# EAGLE design ESP8266 (EAGLE 7.6.0)
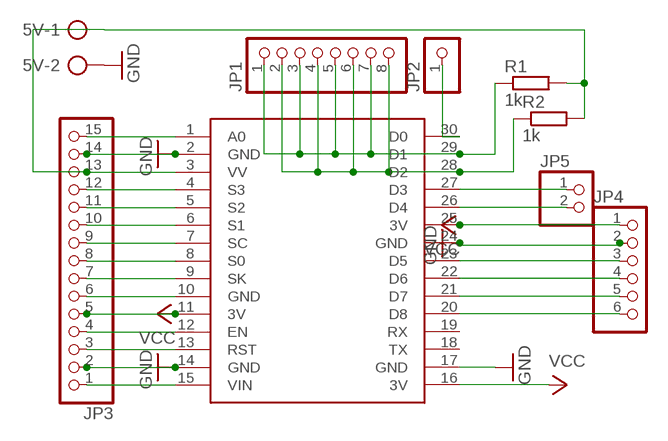
[diagram p0: schematic, sheet 1]

## Parts
5V  AK300/2  [AK300/2]
JP1  PINHD-1X8  [1X08]
JP2  PINHD-1X1  [1X01]
JP3  PINHD-1X15  [1X15]
JP4  PINHD-1X6  [1X06]
JP5  PINHD-1X2  [1X02]
R1  1k  R-EU_0204/7  [0204/7]
R2  1k  R-EU_0204/7  [0204/7]
U$1  NODEMCU  [NODEMCU]

## Nets
GND: 5V.2 JP3.2 JP3.14 JP4.2 U$1.2(GND) U$1.14(GND) U$1.17(GND) U$1.24(GND)
N$1: JP3.1 U$1.15(VIN)
N$2: JP3.3 U$1.13(RST)
N$3: JP3.4 U$1.12(EN)
N$4: JP3.6 U$1.10(GND)
N$5: JP3.7 U$1.9(SK)
N$6: JP3.8 U$1.8(S0)
N$7: JP3.9 U$1.7(SC)
N$8: JP3.10 U$1.6(S1)
N$9: JP3.11 U$1.5(S2)
N$10: JP3.12 U$1.4(S3)
N$11: 5V.1 JP3.13 R1.2 R2.2 U$1.3(VV)
N$12: JP3.15 U$1.1(A0)
N$13: JP2.1
N$14: JP4.3 U$1.23(D5)
N$15: JP4.4 U$1.22(D6)
N$16: JP4.5 U$1.21(D7)
N$17: JP4.6 U$1.20(D8)
N$18: JP5.1 U$1.27(D3)
N$19: JP5.2 U$1.26(D4)
SCL: JP1.1 JP1.3 JP1.5 JP1.7 R1.1 U$1.29(D1)
SDA: JP1.2 JP1.4 JP1.6 JP1.8 R2.1 U$1.28(D2)
VCC: JP3.5 JP4.1 U$1.11(3V) U$1.16(3V) U$1.25(3V)
Unconnected: U$1.18(TX) U$1.19(RX) U$1.30(D0)

## Library data of the parts
5V = con-ptr500:AK300/2: CONNECTOR; OC_FARNELL: unknown; OC_NEWARK: unknown
JP1 = pinhead:PINHD-1X8: PIN HEADER
JP2 = pinhead:PINHD-1X1: PIN HEADER
JP3 = pinhead:PINHD-1X15: PIN HEADER
JP4 = pinhead:PINHD-1X6: PIN HEADER
JP5 = pinhead:PINHD-1X2: PIN HEADER
R1 R2 = rcl:R-EU_: RESISTOR, European symbol
U$1 = nodemcu:NODEMCU

## Board
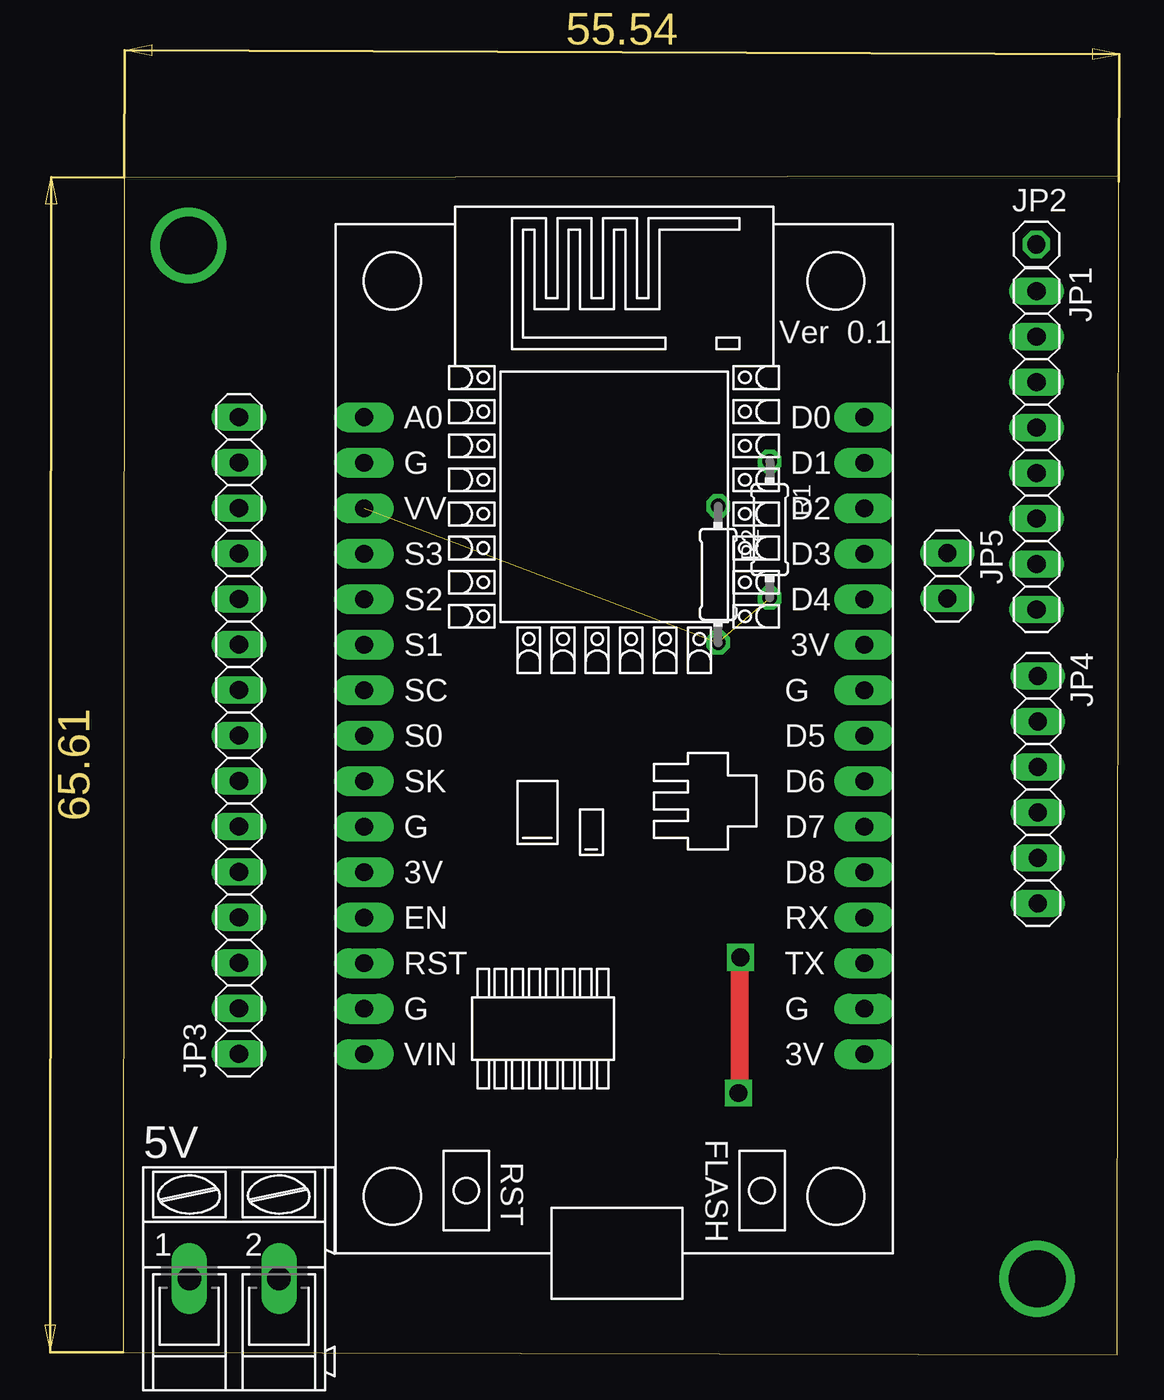
[diagram p1: board, top side]
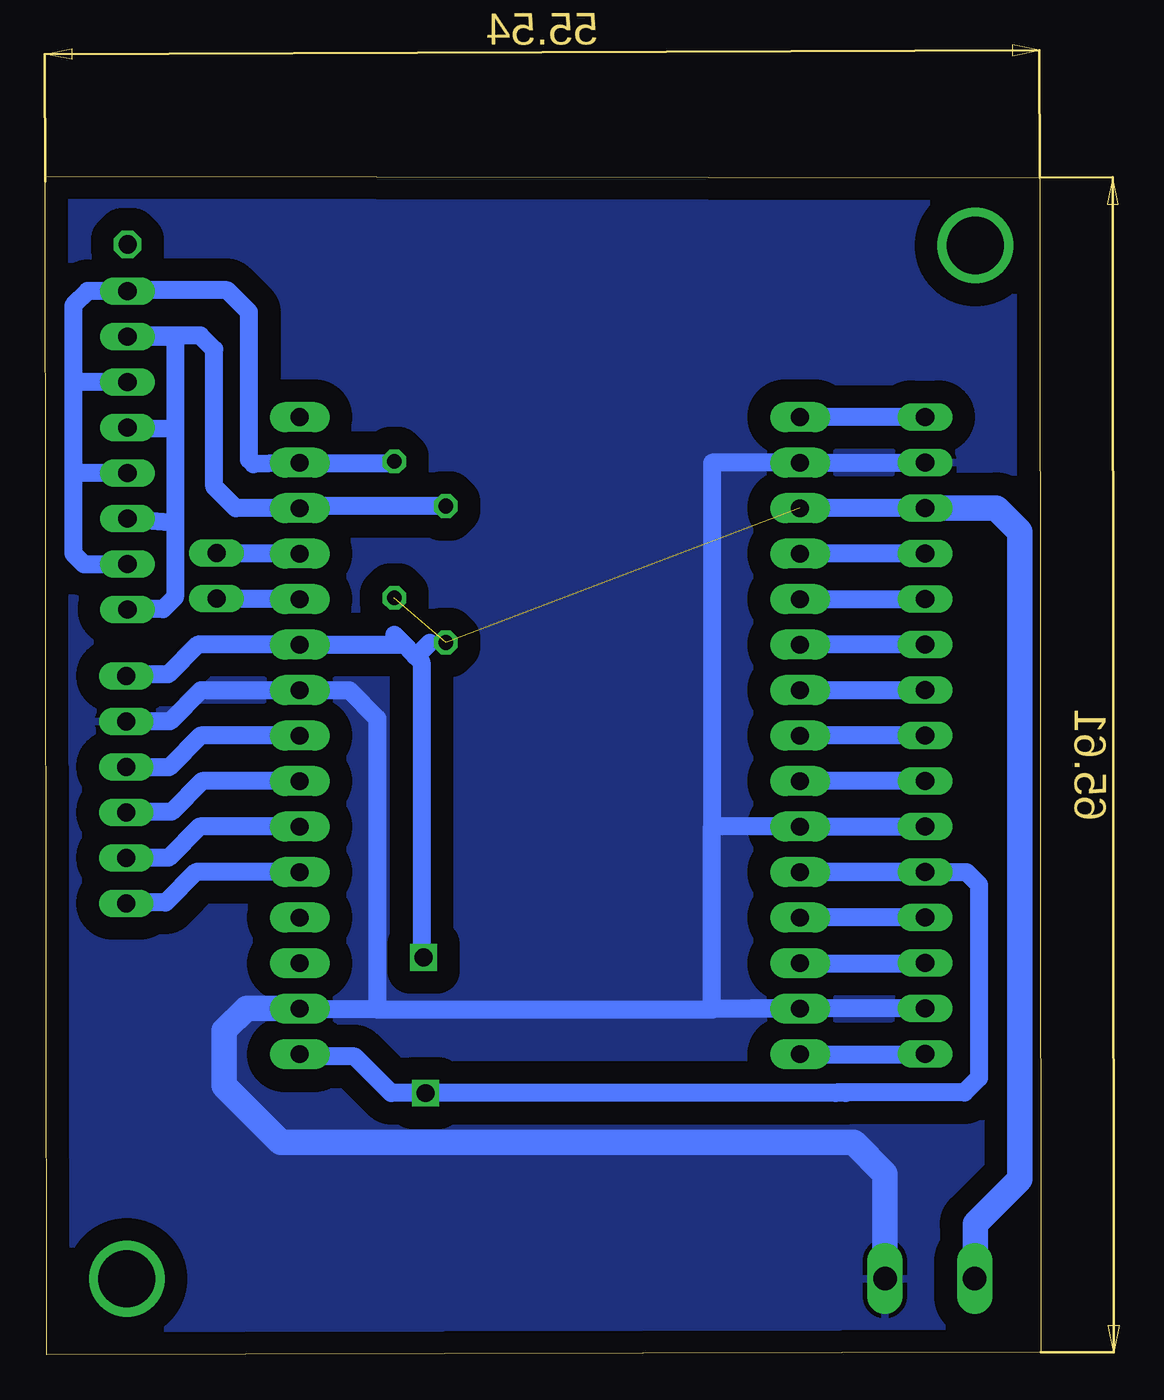
[diagram p2: board, bottom side, seen from below]

Size 55.6 x 65.81 mm. Coordinates in mm from the lower left corner, seen from the top.
Outline: 0,0.13 55.54,0 55.6,65.81 0.07,65.74 0,0.13
Copper layers (1*16): Top 0.035mm / dielectric 1.5mm / Bottom 0.035mm
Design rules "default": minimum track width 10mil, minimum drill 24mil, track to track 8mil, track to pad 8mil, pad to pad 8mil, via to via 8mil, smd to smd 8mil, copper to edge 40mil, drill to drill 8mil, minimum pad ring 10mil, minimum via ring 8mil, stop-mask expansion 4mil, vias tented up to drill 0mil, thermal gap 10mil

### Footprints (pad centres in the part's own frame; a part is rotated, then mirrored left to right if it is on the bottom)
AK300/2 = drill 1.321 long: 1 -2.515,0; 2 2.489,0
1X08 = drill 1.016 long: 1 -8.89,0; 2 -6.35,0; 3 -3.81,0; 4 -1.27,0; 5 1.27,0; 6 3.81,0; 7 6.35,0; 8 8.89,0
1X01 = drill 1.016 octagon: 1 0,0
1X15 = drill 1.016 long: 1 -17.78,0; 2 -15.24,0; 3 -12.7,0; 4 -10.16,0; 5 -7.62,0; 6 -5.08,0; 7 -2.54,0; 8 0,0; 9 2.54,0; 10 5.08,0; 11 7.62,0; 12 10.16,0; 13 12.7,0; 14 15.24,0; 15 17.78,0
1X06 = drill 1.016 long: 1 -6.35,0; 2 -3.81,0; 3 -1.27,0; 4 1.27,0; 5 3.81,0; 6 6.35,0
1X02 = drill 1.016 long: 1 -1.27,0; 2 1.27,0
0204/7 = drill 0.813 octagon: 1 -3.81,0; 2 3.81,0
NODEMCU = drill 1 pad 1.676 long: 1 -13.97,17.78; 2 -13.97,15.24; 3 -13.97,12.7; 4 -13.97,10.16; 5 -13.97,7.62; 6 -13.97,5.08; 7 -13.97,2.54; 8 -13.97,0; 9 -13.97,-2.54; 10 -13.97,-5.08; 11 -13.97,-7.62; 12 -13.97,-10.16; 13 -13.97,-12.7; 14 -13.97,-15.24; 15 -13.97,-17.78; 16 13.97,-17.78; 17 13.97,-15.24; 18 13.97,-12.7; 19 13.97,-10.16; 20 13.97,-7.62; 21 13.97,-5.08; 22 13.97,-2.54; 23 13.97,0; 24 13.97,2.54; 25 13.97,5.08; 26 13.97,7.62; 27 13.97,10.16; 28 13.97,12.7; 29 13.97,15.24; 30 13.97,17.78

### Placement (x,y rotation side)
5V  6.22,4.25 0 top
JP1  51.01,50.51 270 top
JP2  51.01,62 0 top
JP3  6.48,34.58 90 top
JP4  51.08,31.55 270 top
JP5  46.04,43.49 270 top
R1  36.12,46.07 270 top
R2  33.23,43.58 270 top
U$1  27.43,34.56 0 top

### Tracks (layer width: path | path; a pad name or v marks a point on that pad's centre or on a via)
GND
  Bottom 1.016: 18.38,19.33 U$1.14 13.44,19.34 JP3.2 16.12,19.34 | 18.38,19.33 18.38,29.53 | 18.38,29.53 13.46,29.53 | 37.07,19.28 37.07,35.54 38.63,37.1 U$1.24 46.9,37.1 48.64,35.37 51.07,35.37 JP4.2 | 37.07,19.28 41.4,19.28 U$1.17 | 18.38,29.53 18.38,49.81 U$1.2 6.49,49.81 JP3.14 | 37.07,19.28 18.38,19.28 18.38,19.33
  Bottom 1.422: 5V.2 8.71,10.11 10.46,11.86 42.45,11.86 45.61,15.02 45.61,18.1 44.37,19.34 41.42,19.34 U$1.17
  pour Bottom (isolate 1.27): 0.36,65.77 55.5,65.77 55.5,0.05 0.19,0.05 0.19,65.77
N$1
  Bottom 1.016: U$1.15 6.49,16.78 JP3.1
N$2
  Bottom 1.016: U$1.13 6.49,21.87 JP3.3
N$3
  Bottom 1.016: JP3.4 13.44,24.42 U$1.12
N$4
  Bottom 1.016: U$1.10 6.49,29.48 JP3.6
N$5
  Bottom 1.016: JP3.7 13.44,32.04 U$1.9
N$6
  Bottom 1.016: JP3.8 13.44,34.58 U$1.8
N$7
  Bottom 1.016: U$1.7 6.49,37.1 JP3.9
N$8
  Bottom 1.016: JP3.10 13.44,39.66 U$1.6
N$9
  Bottom 1.016: U$1.5 6.49,42.19 JP3.11
N$10
  Bottom 1.016: JP3.12 13.44,44.74 U$1.4
N$11  (2 unrouted)
  Bottom 1.016: JP3.13 13.44,47.28 U$1.3
  Bottom 1.422: JP3.13 2.49,47.28 1.17,45.97 1.17,9.81 3.67,7.31 3.67,4.28 5V.1
N$12
  Bottom 1.016: JP3.15 13.44,52.36 U$1.1
N$14
  Bottom 1.016: U$1.23 46.93,34.56 48.69,32.8 51.06,32.8 JP4.3
N$15
  Bottom 1.016: U$1.22 46.85,32.02 48.56,30.32 51.05,30.32 JP4.4
N$16
  Bottom 1.016: U$1.21 46.99,29.48 48.72,27.75 JP4.5
N$17
  Bottom 1.016: U$1.20 47.2,26.95 48.89,25.25 51.04,25.25 JP4.6
N$18
  Bottom 1.016: JP5.1 41.43,44.76 U$1.27
N$19
  Bottom 1.016: U$1.26 46.01,42.19 JP5.2
N$20  (via drill 3.2 pad 1.27)
  other vias: 3.67,61.94
N$21  (via drill 3.2 pad 1.27)
  other vias: 51.06,4.24
SCL
  Bottom 1.016: 54.03,54.29 54.03,58.61 53.24,59.4 JP1.1 50.98,59.43 45.44,59.43 44.23,58.22 44.23,49.97 43.98,49.72 U$1.29 41.07,49.8 36.2,49.8 R1.1 | 54.03,54.29 54.03,49.24 | 54.03,49.24 54.03,44.73 53.45,44.15 JP1.7 | JP1.3 54.01,54.32 54.03,54.29 | JP1.5 54.02,49.24 54.03,49.24
SDA
  Bottom 1.016: 48.35,51.72 48.35,56.72 48.49,56.86 JP1.2 50.96,56.91 46.95,56.91 46.17,56.13 46.17,48.47 44.97,47.27 U$1.28 41.28,47.39 R2.1 | 48.35,51.72 48.35,46.48 | 48.35,46.48 48.35,42.31 49.03,41.63 51,41.63 JP1.8 | JP1.6 48.35,46.48 | JP1.4 48.35,51.72
VCC  (via drill 1)
  Top 1.016: v34.48,22.18 34.48,21.77 34.43,21.72 34.43,14.67 v34.37,14.61
  Bottom 1.016: U$1.11 11.94,26.95 | 10.9,14.61 11.47,14.61 | 11.47,14.61 v34.37,14.61 36.29,14.61 38.33,16.65 41.26,16.65 U$1.16 | 34.9,38.99 34.6,38.68 34.6,22.29 v34.48,22.18 | JP3.5 11.92,26.96 11.94,26.95 | 11.94,26.95 4.16,26.95 3.47,26.25 3.47,15.45 4.28,14.64 11.44,14.64 11.47,14.61 | JP4.1 51,37.98 48.75,37.98 47.09,39.65 U$1.25 35.56,39.65 | 35.56,39.65 35.05,39.14 34.9,38.99 | 34.12,39.77 34.9,38.99 | 36.12,40.2 35.56,39.65